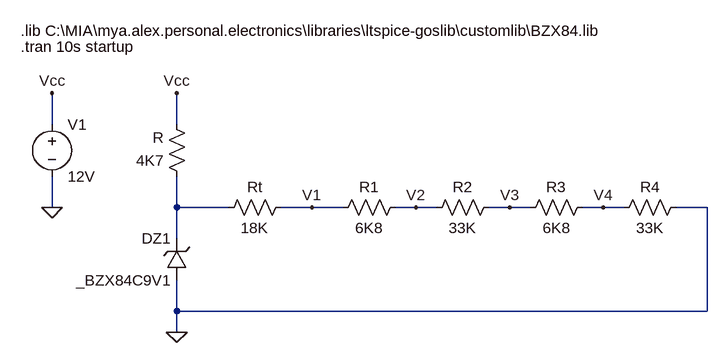
[diagram p0: schematic phase-triggers-voltage-reference.asc]
phase-triggers-voltage-reference.asc, the LTspice schematic file:
Version 4
SHEET 1 1284 680
WIRE -192 -80 -192 -128
WIRE 0 -80 0 -128
WIRE -192 48 -192 0
WIRE 0 48 0 0
WIRE 80 48 0 48
WIRE 208 48 160 48
WIRE 256 48 208 48
WIRE 368 48 336 48
WIRE 400 48 368 48
WIRE 512 48 480 48
WIRE 544 48 512 48
WIRE 656 48 624 48
WIRE 688 48 656 48
WIRE 816 48 768 48
WIRE 0 96 0 48
WIRE 0 208 0 160
WIRE 816 208 816 48
WIRE 816 208 0 208
WIRE 0 240 0 208
FLAG -192 48 0
FLAG -192 -128 Vcc
FLAG 0 240 0
FLAG 0 -128 Vcc
FLAG 208 48 V1
FLAG 368 48 V2
FLAG 512 48 V3
FLAG 656 48 V4
SYMBOL voltage -192 -96 R0
WINDOW 123 0 0 Left 0
WINDOW 39 0 0 Left 0
SYMATTR InstName V1
SYMATTR Value 12V
SYMBOL res 16 16 R180
WINDOW 0 36 76 Left 2
WINDOW 3 36 40 Left 2
SYMATTR InstName R
SYMATTR Value 4K7
SYMBOL zener 16 160 R180
WINDOW 0 24 64 Left 2
WINDOW 3 24 0 Left 2
SYMATTR InstName DZ1
SYMATTR Value _BZX84C9V1
SYMBOL res 64 64 R270
WINDOW 0 32 56 VTop 2
WINDOW 3 0 56 VBottom 2
SYMATTR InstName Rt
SYMATTR Value 18K
SYMBOL res 240 64 R270
WINDOW 0 32 56 VTop 2
WINDOW 3 0 56 VBottom 2
SYMATTR InstName R1
SYMATTR Value 6K8
SYMBOL res 384 64 R270
WINDOW 0 32 56 VTop 2
WINDOW 3 0 56 VBottom 2
SYMATTR InstName R2
SYMATTR Value 33K
SYMBOL res 528 64 R270
WINDOW 0 32 56 VTop 2
WINDOW 3 0 56 VBottom 2
SYMATTR InstName R3
SYMATTR Value 6K8
SYMBOL res 672 64 R270
WINDOW 0 32 56 VTop 2
WINDOW 3 0 56 VBottom 2
SYMATTR InstName R4
SYMATTR Value 33K
TEXT -240 -200 Left 2 !.tran 10s startup
TEXT -240 -224 Left 2 !.lib C:\\MIA\\mya.alex.personal.electronics\\libraries\\ltspice-goslib\\customlib\\BZX84.lib

The netlist it stands for:
* phase-triggers-voltage-reference.asc
V1 Vcc 0 12V
R N001 Vcc 4K7
DZ1 0 N001 _BZX84C9V1
Rt N001 V1 18K
R1 V1 V2 6K8
R2 V2 V3 33K
R3 V3 V4 6K8
R4 V4 0 33K
.model D D
.lib standard.dio
.tran 10s startup
.lib C:\MIA\mya.alex.personal.electronics\libraries\ltspice-goslib\customlib\BZX84.lib
.backanno
.end